# Altium schematic sheet SmartDoor.SchDoc
size A3; SheetNumber: 1; SheetTotal: 1
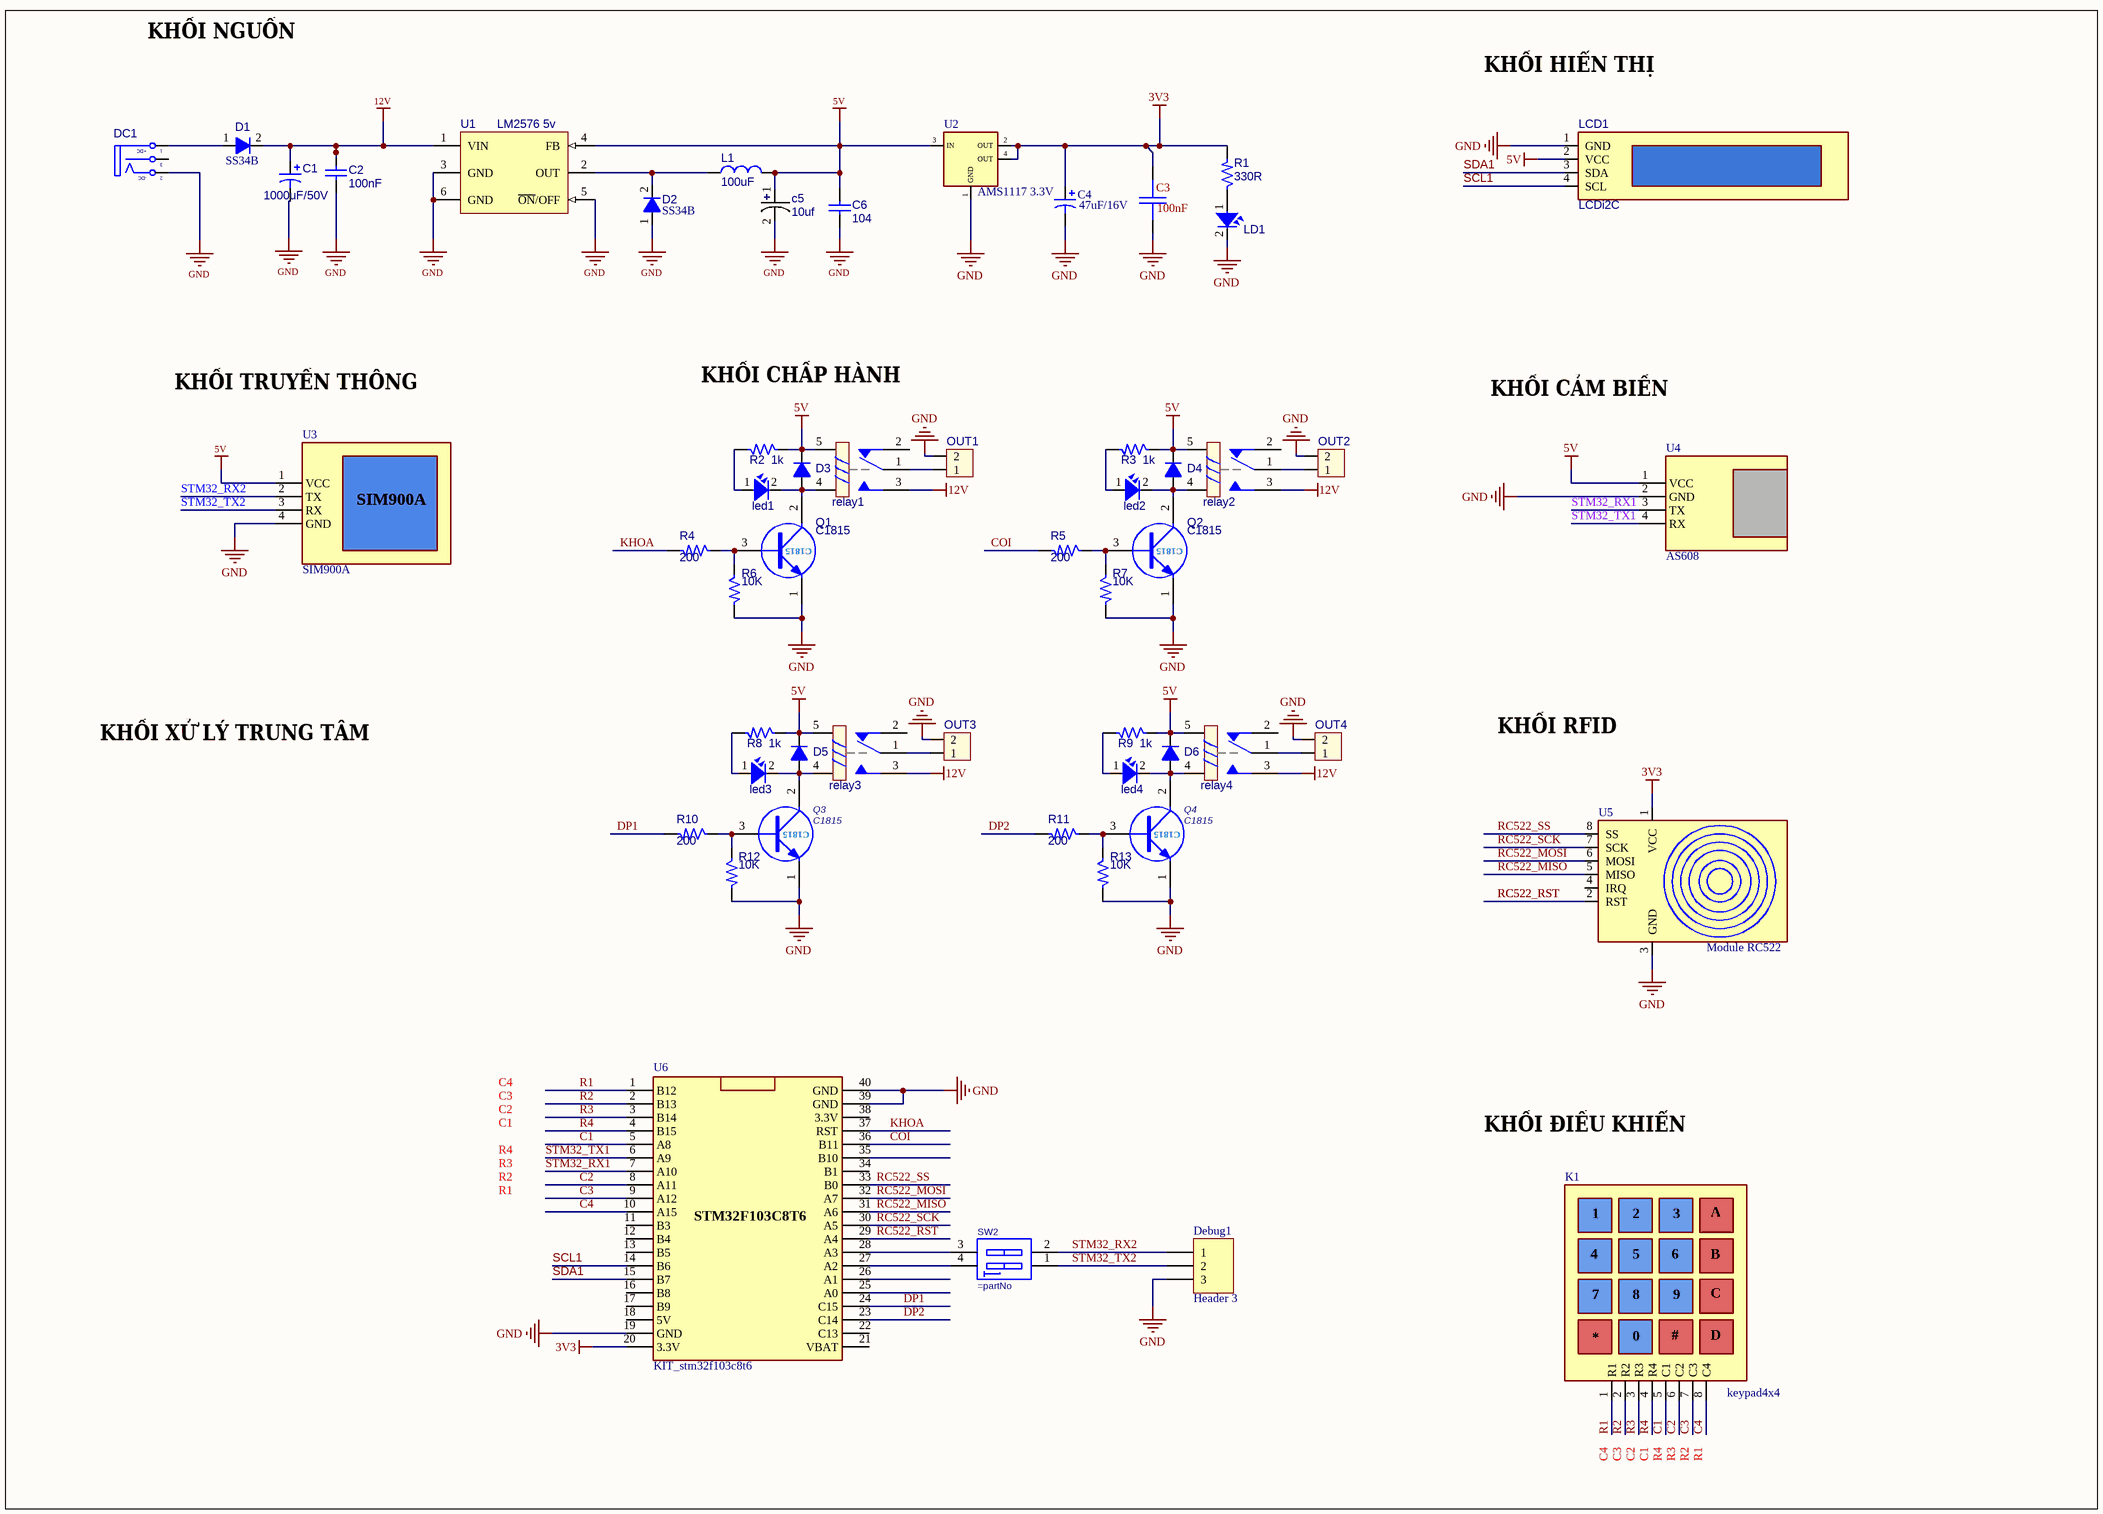
[diagram p0: SmartDoor.SchDoc]

## Parts
C1  value 1000uF/50V  [C_EL_10_12]  (hidden comment: 1000uF-50V-DIP)
C2  value 100nF  [C0805S]  (hidden comment: 100nF-50V-126)
C3  value 100nF  [C0805S]  (hidden comment: 0.1uF)
C4  value 47uF/16V  [6032]  (hidden comment: Tanta-47uF-16V-2917)
c5  10uf  [C_EL_10_9]
C6  104  [C0805S]
D1  SS34B  [D_SMB]
D2  SS34B  [D_SMB]
D3  diode  [D_SMA]  (value not drawn)
D4  diode  [D_SMA]  (value not drawn)
D5  diode  [D_SMA]  (value not drawn)
D6  diode  [D_SMA]  (value not drawn)
DC1  Jack DC5.5x2.5MM DC5525  [DC-IN]  (value not drawn)
Debug1  Header 3  [HDR_M_1X3]
K1  keypad4x4  [XH_8]
L1  100uF  [L_12]
LCD1  LCDi2C  [XH_4]
LD1  led 0805 green  [LED0805GRN]  (value not drawn)
led1  led  [led 5mm red dip]  (value not drawn)
led2  led  [led 5mm red dip]  (value not drawn)
led3  led  [led 5mm red dip]  (value not drawn)
led4  led  [led 5mm red dip]  (value not drawn)
OUT1  con2  [MSTBF_2]  (value not drawn)
OUT2  con2  [MSTBF_2]  (value not drawn)
OUT3  con2  [MSTBF_2]  (value not drawn)
OUT4  con2  [MSTBF_2]  (value not drawn)
Q1  C1815  [TO-92W]
Q2  C1815  [TO-92W]
Q3  C1815  [TO-92B]
Q4  C1815  [TO-92B]
R1  330R  [R0805E]
R2  1k  [R0805E]
R3  1k  [R0805E]
R4  200  [R0125W_AX03]
R5  200  [R0125W_AX03]
R6  10K  [R0805E]
R7  10K  [R0805E]
R8  1k  [R0805E]
R9  1k  [R0805E]
R10  200  [R0125W_AX03]
R11  200  [R0125W_AX03]
R12  10K  [R0805E]
R13  10K  [R0805E]
relay1  relay2  [RL_SPDT_10A]  (value not drawn)
relay2  relay2  [RL_SPDT_10A]  (value not drawn)
relay3  relay2  [RL_SPDT_10A]  (value not drawn)
relay4  relay2  [RL_SPDT_10A]  (value not drawn)
SW2  (no value)  [SW2_DIP]
U1  LM2576 5v  [TO-263-5L, D2PAK-5, DDPAK, FMG170_5_S1000]
U2  AMS1117 3.3V  [ASM1117-3V3]
U3  SIM900A  [XH_4]
U4  AS608  [XH_4]
U5  Module RC522  [XH_8]
U6  KIT_stm32f103c8t6  [KIT_stm32f103]

## Nets
3V3: C3.2 C4.1 R1.2 U2.2(OUT) U2.4(OUT) U5.1(VCC) U6.20(3.3V)
5V: c5.1 C6.2 D3.2(K) D4.2(K) D5.2(K) D6.2(K) L1.2 LCD1.2(VCC) R2.1 R3.1 R8.1 R9.1 relay1.5 relay2.5 relay3.5 relay4.5 U1.4(FB) U2.3(IN) U3.1(VCC) U4.1(VCC)
12V: C1.1 C2.1 D1.2(K) relay1.3 relay2.3 relay3.3 relay4.3 U1.1(VIN)
GND: C1.2 C2.2 C3.1 C4.2 c5.2 C6.1 D2.1(A) DC1.2(TN) Debug1.3 LCD1.1(GND) LD1.2 OUT1.2 OUT2.2 OUT3.2 OUT4.2 Q1.1(E) Q2.1(E) Q3.1(E) Q4.1(E) R6.2 R7.2 R12.2 R13.2 U1.3(GND) U1.5(~{ON}/OFF) U1.6(GND) U2.1(GND) U3.4(GND) U4.2(GND) U5.3(GND) U6.19(GND) U6.39(GND) U6.40(GND)
C1: K1.5(C1) U6.5(A8)
C2: K1.6(C2) U6.8(A11)
C3: K1.7(C3) U6.9(A12)
C4: K1.8(C4) U6.10(A15)
COI: R5.2 U6.36(B11)
DP1: R10.2 U6.24(C15)
DP2: R11.2 U6.23(C14)
KHOA: R4.2 U6.37(RST)
R1: K1.1(R1) U6.1(B12)
R2: K1.2(R2) U6.2(B13)
R3: K1.3(R3) U6.3(B14)
R4: K1.4(R4) U6.4(B15)
RC522_MISO: U5.5(MISO) U6.31(A6)
RC522_MOSI: U5.6(MOSI) U6.32(A7)
RC522_RST: U5.2(RST) U6.29(A4)
RC522_SCK: U5.7(SCK) U6.30(A5)
RC522_SS: U5.8(SS) U6.33(B0)
SCL1: LCD1.4(SCL) U6.14(B6)
SDA1: LCD1.3(SDA) U6.15(B7)
STM32_RX1: U4.3(TX) U6.7(A10)
STM32_RX2: Debug1.1 SW2.2 U3.2(TX)
STM32_TX1: U4.4(RX) U6.6(A9)
STM32_TX2: Debug1.2 SW2.1 U3.3(RX)
NetD1_1: D1.1(A) DC1.1(T)
NetD2_2: D2.2(K) L1.1 U1.2(OUT)
NetD3_1: D3.1(A) led1.2 Q1.2(C) relay1.4
NetD4_1: D4.1(A) led2.2 Q2.2(C) relay2.4
NetD5_1: D5.1(A) led3.2 Q3.2(C) relay3.4
NetD6_1: D6.1(A) led4.2 Q4.2(C) relay4.4
NetLD1_1: LD1.1(A) R1.1
Netled1_1: led1.1(A) R2.2
Netled2_1: led2.1(A) R3.2
Netled3_1: led3.1(A) R8.2
Netled4_1: led4.1(A) R9.2
NetOUT1_1: OUT1.1 relay1.1
NetOUT2_1: OUT2.1 relay2.1
NetOUT3_1: OUT3.1 relay3.1
NetOUT4_1: OUT4.1 relay4.1
NetQ1_3: Q1.3(B) R4.1 R6.1
NetQ2_3: Q2.3(B) R5.1 R7.1
NetQ3_3: Q3.3(B) R10.1 R12.1
NetQ4_3: Q4.3(B) R11.1 R13.1
NetSW2_3: SW2.3 U6.28(A3)
NetSW2_4: SW2.4 U6.27(A2)

Not connected (* = marked no-connect by the designer): DC1 3(S); relay1 2; relay2 2; relay3 2; relay4 2; U5 4(IRQ); U6 11(B3) 12(B4) 13(B5) 16(B8) 17(B9) 18(5V) 21(VBAT) 22(C13) 25(A0) 26(A1) 34(B1) 35(B10) 38(3.3V)

## Notes on the sheet
- KHỐI NGUỒN
- KHỐI HIỂN THỊ
- KHỐI CHẤP HÀNH
- KHỐI TRUYỀN THÔNG
- KHỐI CẢM BIẾN
- KHỐI XỬ LÝ TRUNG TÂM
- KHỐI RFID
- KHỐI ĐIỀU KHIỂN
- Labels drawn without touching a wire or pin: C1, C2, C3, C4, R1, R2, R3, R4
- (in symbol DCIN) +DC; -DC
- (in symbol keypad) A; B; C; 9; 0; #; D
- (in symbol KIT_stm32f103c8t6) STM32F103C8T6

## Library data of the parts
C1 C4 = Cap Pol1: Polarized Capacitor (Radial); Published: 8-Jun-2000; LatestRevisionDate: 17-Jul-2002; LatestRevisionNote: Re-released for DXP Platform.; PackageReference: RB7.6-15; Publisher: Altium Limited
C2 = Cap: Capacitor; Published: 8-Jun-2000; LatestRevisionDate: 17-Jul-2002; LatestRevisionNote: Re-released for DXP Platform.; PackageReference: RAD-0.3; Publisher: Altium Limited
C3 = C0402: Capacitor, Ceramic Chip, 16V, X7R, 10%; Manufacturer: Samsung Electromechanics; PartNumber: CL05B104KO5NNNC; Area: 2800; ComponentHeight: 0.022; SymbolVersion: 07/31/2009 12:17:27; PackageReference: 0402; ComponentLink1Description: AEO Datasheet Link
c5 = radial
C6 = Cap 104_SMD: Capacitor (Semiconductor SIM Model); Value: 0.1uF; Published: 8-Jun-2000; LatestRevisionDate: 17-Jul-2002; LatestRevisionNote: Re-released for DXP Platform.; PackageReference: C1206; Publisher: Altium Limited
D1 D2 = diode
DC1 = DCIN: Jac DC input; Value: Jac DC
Debug1 = Header 3: Header, 3-Pin; LatestRevisionDate: 17-Jul-2002; LatestRevisionNote: Re-released for DXP Platform.; Publisher: Altium Limited
K1 = keypad
L1 = L1: Inductor; Value: 150 mH
LD1 = led
R1-R13 = R: Resistor 1/4W; Value: R1/4W - 1K
SW2 = SWDIP2: WS-DITV 2.54 mm small compact THT flat actuator with top tape; Manufacturer: Wurth Elektronik; Part No.: 418127160902; ComponentLink1 Description: Manufacturer; ComponentLink2 Description: Datasheet; Pole: 02; Created Date: Dec.2015; ComponentLink1URL: http://www.we-online.com; ComponentLink2URL: http://katalog.we-online.de/em/datasheet/4181271609xx.pdf; Created by: Baojun Chen
U1 = LM2576T-5.0: SIMPLE SWITCHER; 3A Step-Down Voltage Regulator; Manufacturer: National Semiconductor; PackageTopMarking: NSUZXYTT*LM2576T*-5.0 P+; PowerWise: N; FirstPublished: 4-Dec-2008; DatasheetVersion: Aug-2004; PackageVersion: revJ, Jan-1992; PackageReference: T05A; Publisher: Altium Limited; PackageDescription: TO-220, Molded, 5 Lead, Straight; CompType: Switcher; PartNumber: LM2576T-5.0; RoHS: O; PinCount: 5; DigiKeyPartNumber: LM2576T-5.0-ND; Code_JEDEC: TO-220-AB; ComponentLink1Description: LM2576 Datasheet; ComponentLink1URL: http://www.national.com/ds/LM/LM2576.pdf; ComponentLink2Description: LM2576 Web Page; ComponentLink2URL: http://www.national.com/pf/LM/LM2576.html; ComponentLink3Description: T05A Package Page; ComponentLink3URL: http://www.national.com/packaging/folders/t05a.html
U2 = AMS1117
U4 = R307